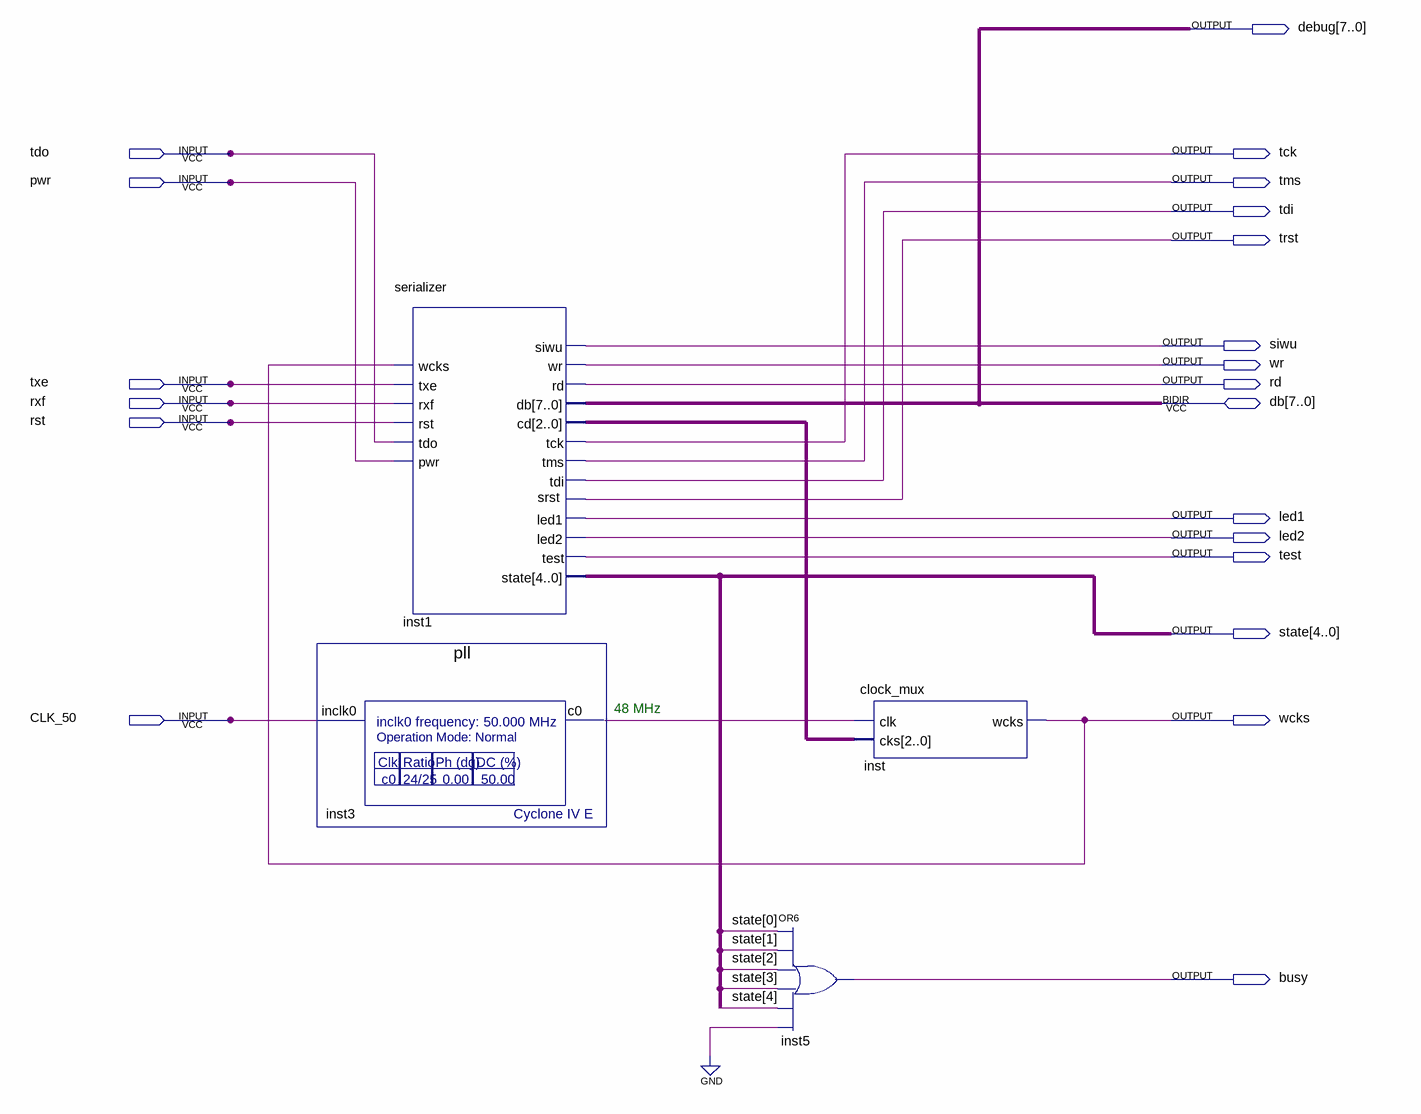
[diagram p0: schematic sheet]
// Quartus schematic Open_JTAG.bdf as structural Verilog: 4 symbols, 21 pins
module Open_JTAG (
  input  tdo,
  input  pwr,
  input  txe,
  input  rxf,
  input  rst,
  input  CLK_50,
  inout  [7:0] db,
  output [7:0] debug,
  output tck,
  output tms,
  output tdi,
  output trst,
  output siwu,
  output wr,
  output rd,
  output led1,
  output led2,
  output test,
  output [4:0] state,
  output wcks,
  output busy
);

  wire inst3_c0;
  wire [2:0] inst1_cd;

  pll inst3 (.inclk0(CLK_50), .c0(inst3_c0));
  serializer inst1 (
    .wcks(wcks), .txe(txe), .rxf(rxf), .rst(rst), .tdo(tdo), .pwr(pwr), .wr(wr), .rd(rd), .siwu(siwu),
    .cd(inst1_cd), .tck(tck), .tms(tms), .tdi(tdi), .led1(led1), .led2(led2), .test(test), .state(state),
    .srst(trst), .db(db));
  or inst5 (busy, state[0], state[1], state[2], state[3], state[4], 1'b0);
  clock_mux inst (.clk(inst3_c0), .cks(inst1_cd), .wcks(wcks));

  assign debug = db;

  // Notes on the sheet:
  //   48 MHz
endmodule
